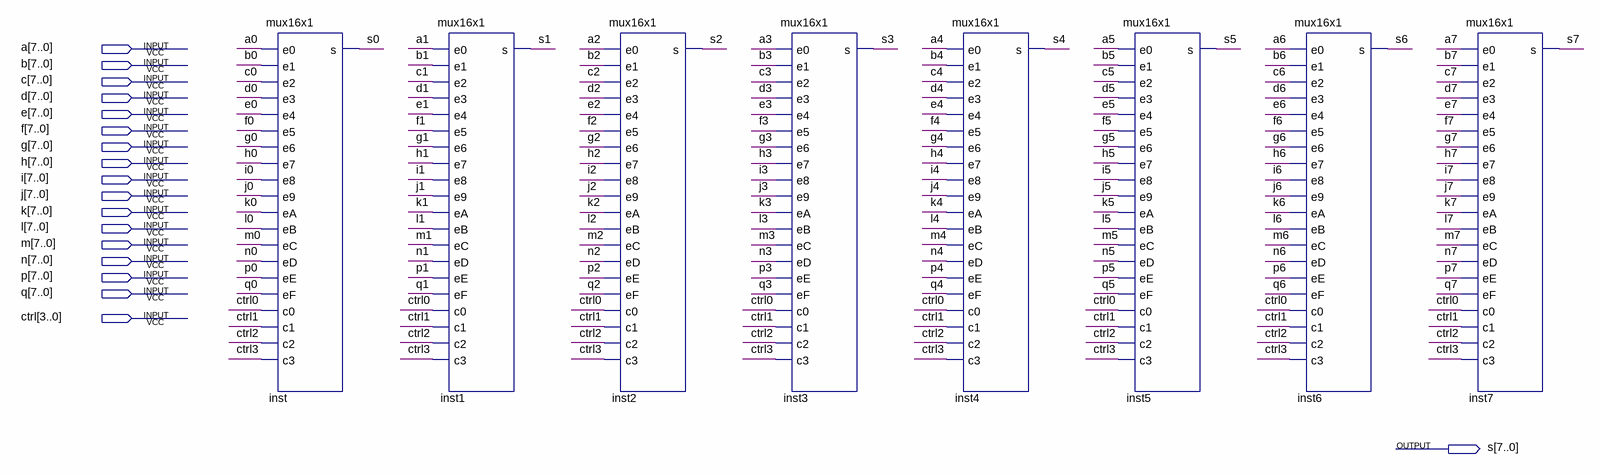
[diagram p0: schematic sheet]
// Quartus schematic mux16x1_8bitsa.bdf as structural Verilog: 8 symbols, 18 pins
module mux16x1_8bitsa (
  input  [7:0] a,
  input  [7:0] b,
  input  [7:0] c,
  input  [7:0] d,
  input  [7:0] e,
  input  [7:0] f,
  input  [7:0] g,
  input  [7:0] h,
  input  [7:0] i,
  input  [7:0] j,
  input  [7:0] k,
  input  [7:0] l,
  input  [7:0] m,
  input  [7:0] n,
  input  [7:0] p,
  input  [7:0] q,
  input  [3:0] ctrl,
  output [7:0] s
);

  mux16x1 inst (
    .e0(a[0]), .e1(b[0]), .e2(c[0]), .e3(d[0]), .e4(e[0]), .e5(f[0]), .e6(g[0]), .e7(h[0]), .e8(i[0]),
    .e9(j[0]), .eA(k[0]), .eB(l[0]), .eC(m[0]), .eD(n[0]), .eE(p[0]), .eF(q[0]), .c0(ctrl[0]), .c1(ctrl[1]),
    .c2(ctrl[2]), .c3(ctrl[3]), .s(s[0]));
  mux16x1 inst1 (
    .e0(a[1]), .e1(b[1]), .e2(c[1]), .e3(d[1]), .e4(e[1]), .e5(f[1]), .e6(g[1]), .e7(h[1]), .e8(i[1]),
    .e9(j[1]), .eA(k[1]), .eB(l[1]), .eC(m[1]), .eD(n[1]), .eE(p[1]), .eF(q[1]), .c0(ctrl[0]), .c1(ctrl[1]),
    .c2(ctrl[2]), .c3(ctrl[3]), .s(s[1]));
  mux16x1 inst2 (
    .e0(a[2]), .e1(b[2]), .e2(c[2]), .e3(d[2]), .e4(e[2]), .e5(f[2]), .e6(g[2]), .e7(h[2]), .e8(i[2]),
    .e9(j[2]), .eA(k[2]), .eB(l[2]), .eC(m[2]), .eD(n[2]), .eE(p[2]), .eF(q[2]), .c0(ctrl[0]), .c1(ctrl[1]),
    .c2(ctrl[2]), .c3(ctrl[3]), .s(s[2]));
  mux16x1 inst3 (
    .e0(a[3]), .e1(b[3]), .e2(c[3]), .e3(d[3]), .e4(e[3]), .e5(f[3]), .e6(g[3]), .e7(h[3]), .e8(i[3]),
    .e9(j[3]), .eA(k[3]), .eB(l[3]), .eC(m[3]), .eD(n[3]), .eE(p[3]), .eF(q[3]), .c0(ctrl[0]), .c1(ctrl[1]),
    .c2(ctrl[2]), .c3(ctrl[3]), .s(s[3]));
  mux16x1 inst4 (
    .e0(a[4]), .e1(b[4]), .e2(c[4]), .e3(d[4]), .e4(e[4]), .e5(f[4]), .e6(g[4]), .e7(h[4]), .e8(i[4]),
    .e9(j[4]), .eA(k[4]), .eB(l[4]), .eC(m[4]), .eD(n[4]), .eE(p[4]), .eF(q[4]), .c0(ctrl[0]), .c1(ctrl[1]),
    .c2(ctrl[2]), .c3(ctrl[3]), .s(s[4]));
  mux16x1 inst5 (
    .e0(a[5]), .e1(b[5]), .e2(c[5]), .e3(d[5]), .e4(e[5]), .e5(f[5]), .e6(g[5]), .e7(h[5]), .e8(i[5]),
    .e9(j[5]), .eA(k[5]), .eB(l[5]), .eC(m[5]), .eD(n[5]), .eE(p[5]), .eF(q[5]), .c0(ctrl[0]), .c1(ctrl[1]),
    .c2(ctrl[2]), .c3(ctrl[3]), .s(s[5]));
  mux16x1 inst6 (
    .e0(a[6]), .e1(b[6]), .e2(c[6]), .e3(d[6]), .e4(e[6]), .e5(f[6]), .e6(g[6]), .e7(h[6]), .e8(i[6]),
    .e9(j[6]), .eA(k[6]), .eB(l[6]), .eC(m[6]), .eD(n[6]), .eE(p[6]), .eF(q[6]), .c0(ctrl[0]), .c1(ctrl[1]),
    .c2(ctrl[2]), .c3(ctrl[3]), .s(s[6]));
  mux16x1 inst7 (
    .e0(a[7]), .e1(b[7]), .e2(c[7]), .e3(d[7]), .e4(e[7]), .e5(f[7]), .e6(g[7]), .e7(h[7]), .e8(i[7]),
    .e9(j[7]), .eA(k[7]), .eB(l[7]), .eC(m[7]), .eD(n[7]), .eE(p[7]), .eF(q[7]), .c0(ctrl[0]), .c1(ctrl[1]),
    .c2(ctrl[2]), .c3(ctrl[3]), .s(s[7]));
endmodule
